# EasyEDA Pro project ProProject_工科大_2023-11-10.epro, board master control
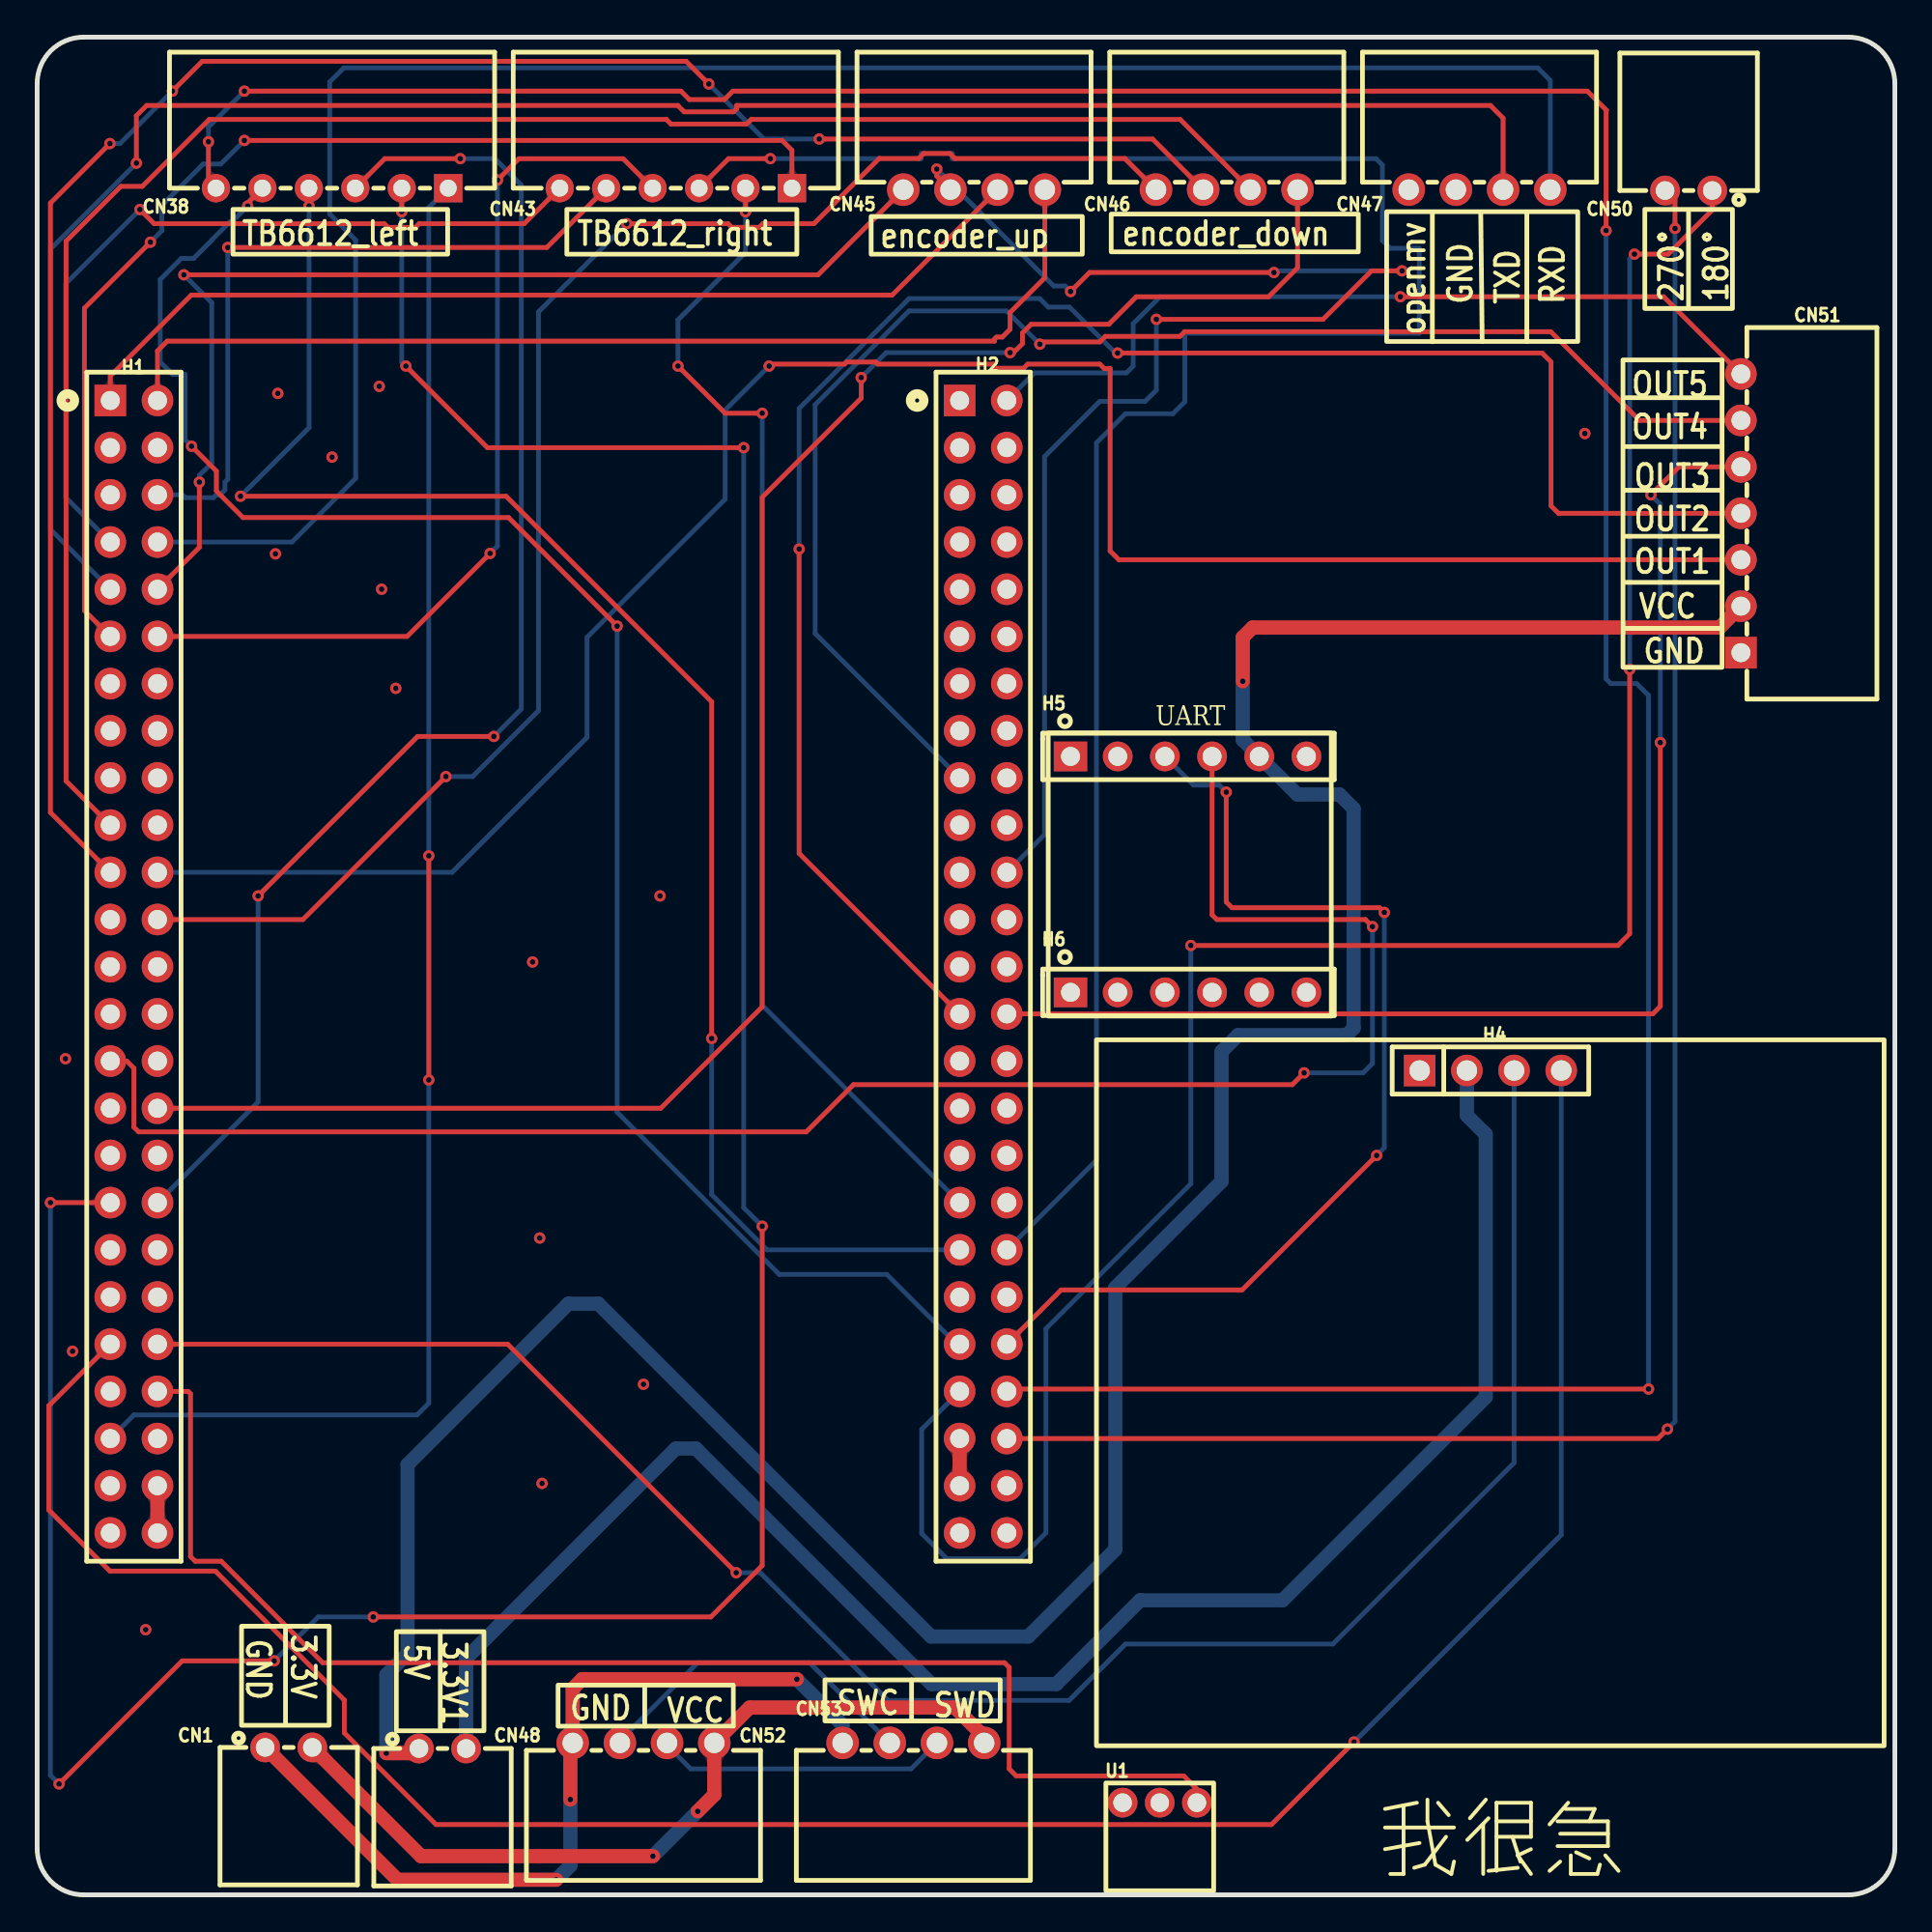
[diagram p3: board, top side]
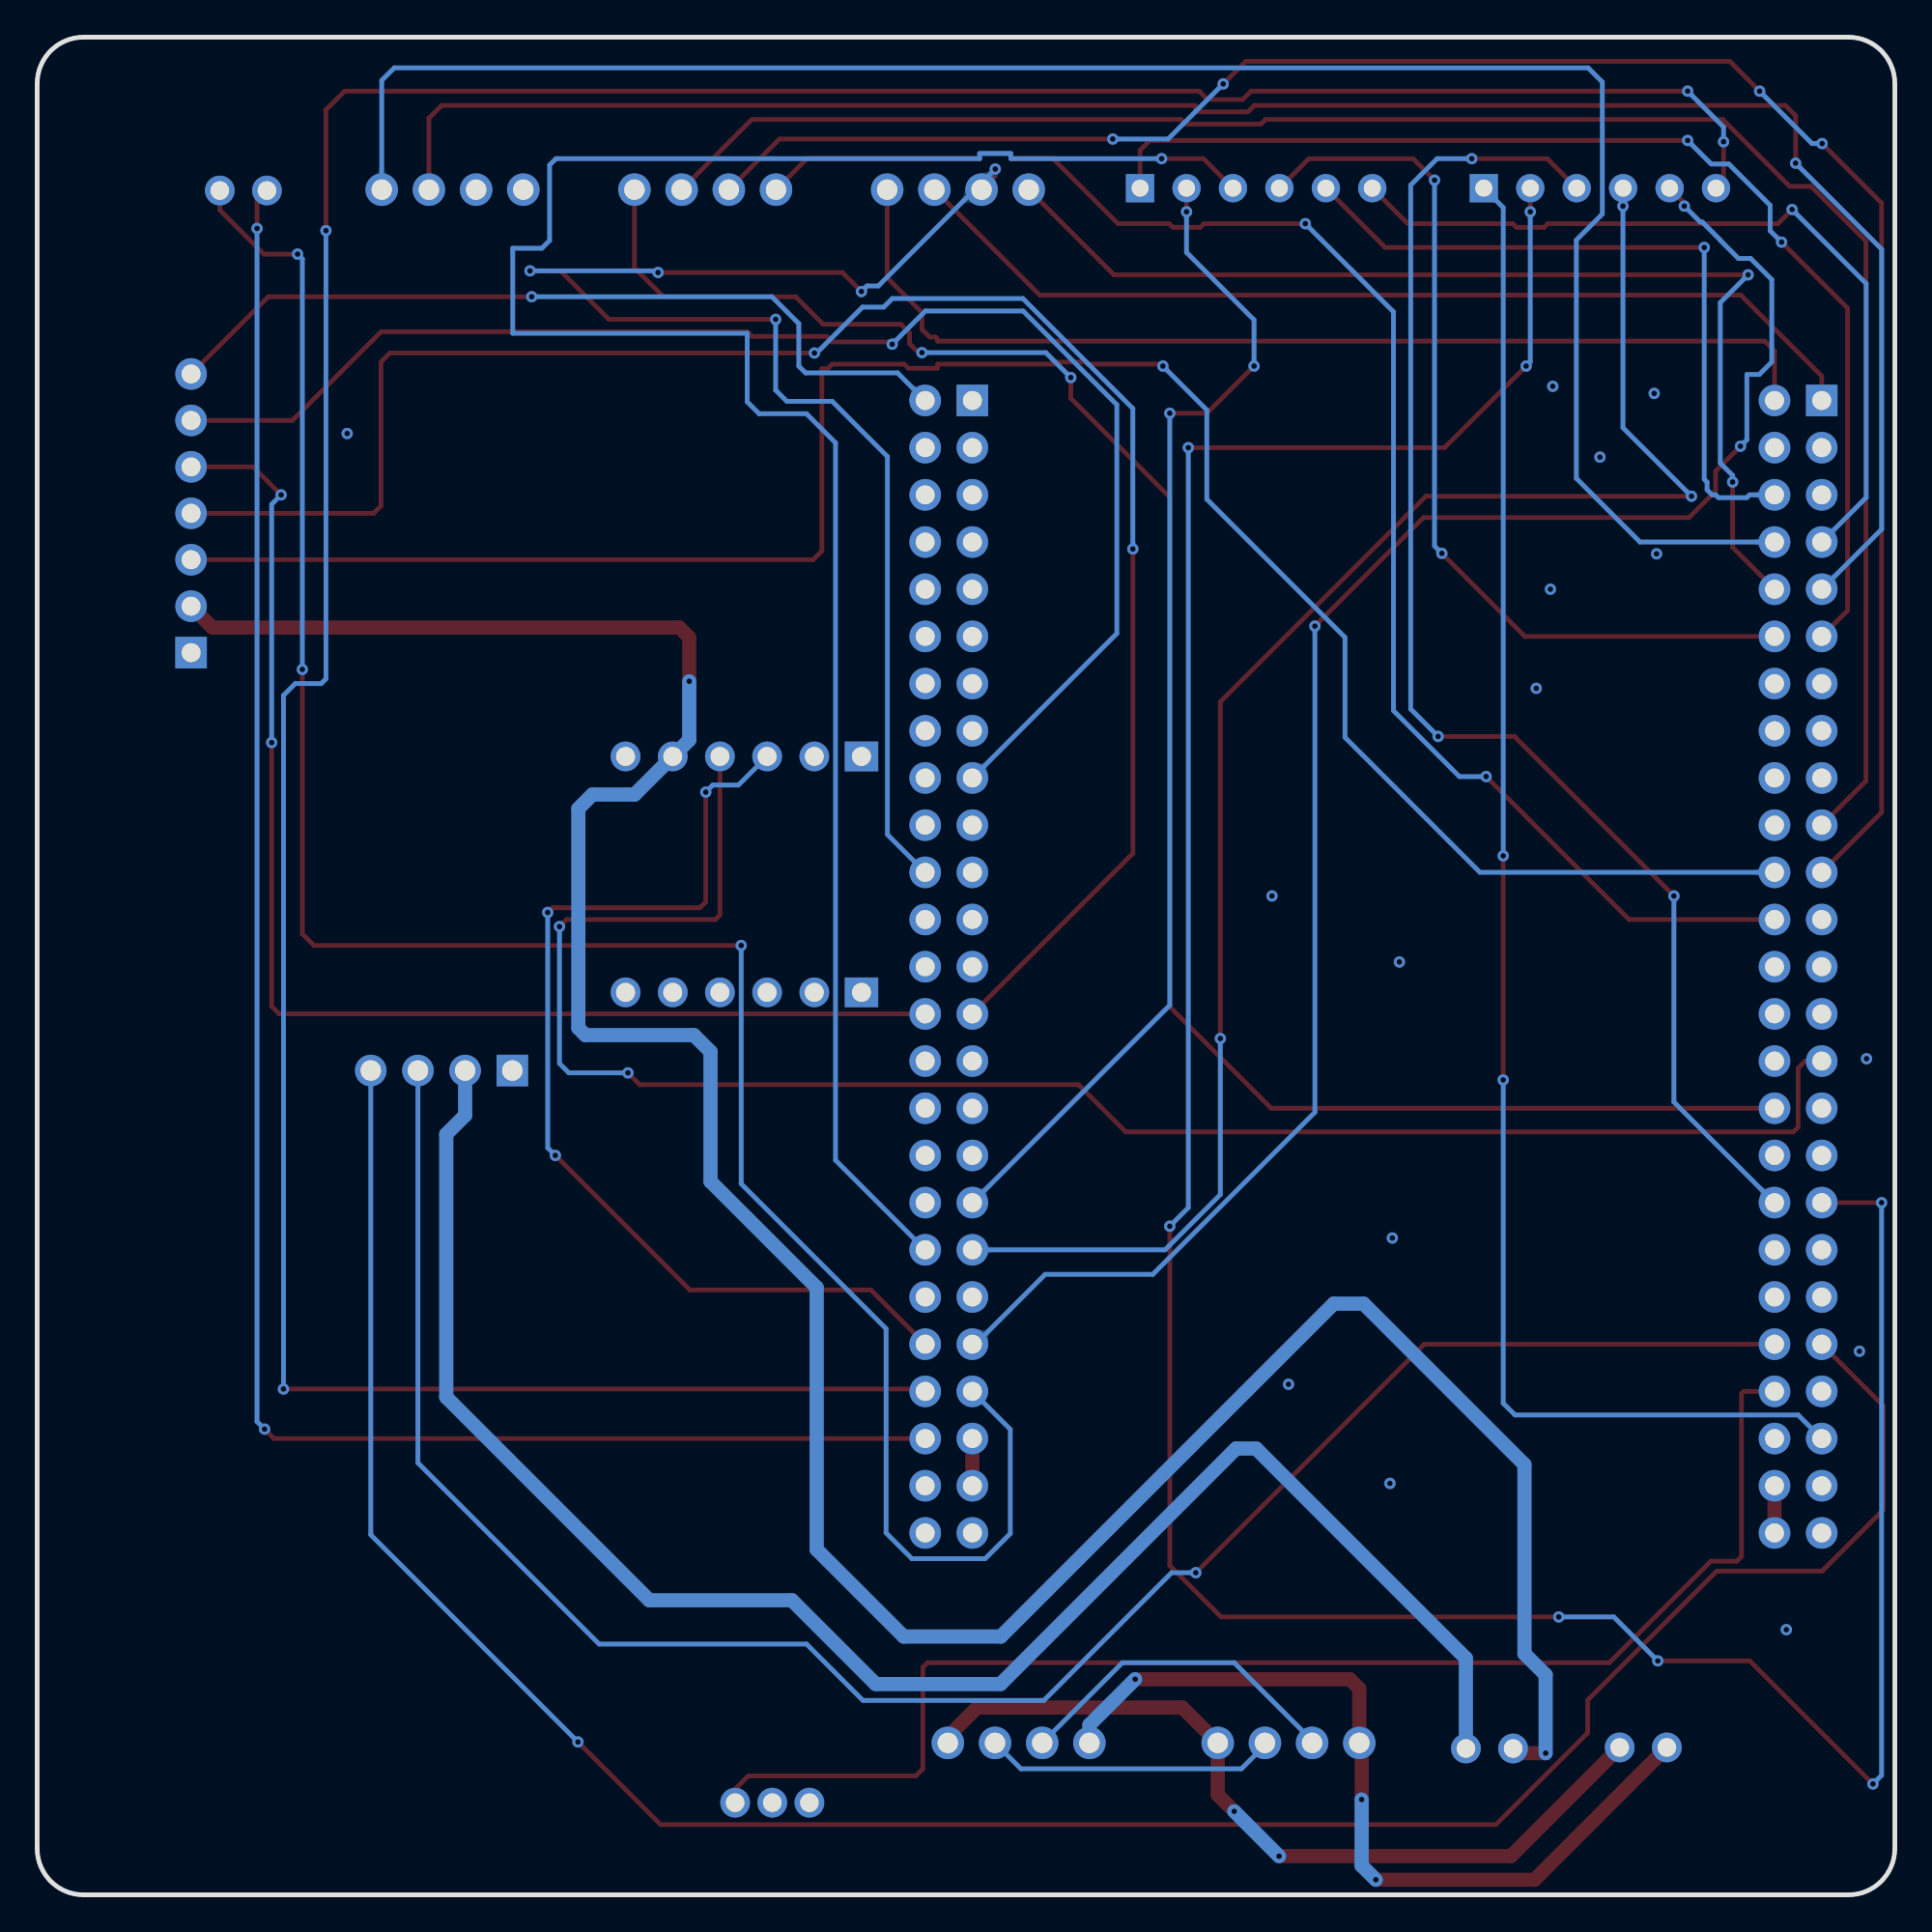
[diagram p4: board, bottom side, seen from below]

Outline 100 x 100 mm; copper layers: Top Layer, Bottom Layer. Coordinates in mm from the lower left corner of the outline.
Outline path: 0,97.5 0,2.5 arc(0.73,0.73) 2.5,0 97.5,0 arc(99.27,0.73) 100,2.5 100,97.5 arc(99.27,99.27) 97.5,100 2.5,100 arc(0.73,99.27) 0,97.5
Stack: Top Layer 0.035mm / Dielectric1 1.51mm FR4 er 4.5 / Bottom Layer 0.035mm

## Design rules (mm)
template: 我很急
spacing copperThickness1oz: track to track 0.102, other pairs 0.152 to 0.3
spacing copperThickness2oz (default): track to track 0.203, other pairs 0.203 to 0.203
spacing VCC和GND: track to track 0.762, other pairs 0.152 to 0.3
track width copperThickness1oz (default): min 0.254, default 0.254, max 1.016
track width copperThickness2oz: min 0.203, default 0.254, max 2.54
track width VCC AND GND: min 0.254, default 0.762, max 0.762
track width 9.6V: min 0.762, default 1.016, max 1.016
differential pair differentialPair (default): width min 0.127, default 0.254, max 2.54; gap min 0.152, default 0.152
via viaSize (default): diameter min 0.5, default 0.61, max 10; hole min 0.3, default 0.305, max 6.299
net GND uses VCC AND GND
net 5V uses VCC AND GND
net VREF uses VCC AND GND
net 3.3V uses VCC AND GND
net 3.3V1 uses VCC AND GND

## Placement (name value [footprint] x y rotation side)
CN1  3.3V  [CONN-TH_XH-2AW_C2908611]  13.54 7.94 0 top
CN38  TB6612 1  [CONN-TH_6P-P2.50_HC-XH-6AW-G]  15.88 91.87 180 top
CN43  TB6612 1  [CONN-TH_6P-P2.50_HC-XH-6AW-G]  34.38 91.87 180 top
CN45  编码器上  [CONN-TH_XH-4AW]  50.43 91.79 180 top
CN46  编码器下  [CONN-TH_XH-4AW]  64.04 91.79 180 top
CN47  openmv  [CONN-TH_XH-4AW]  77.64 91.79 180 top
CN48  3.3V  [CONN-TH_XH-2AW_C2908611]  21.82 7.88 0 top
CN50  SERVO  [CONN-TH_XH-2AW_C2908611]  88.9 91.75 180 top
CN51  HC-XH-7AW-G  [CONN-TH_7P-P2.50_HC-XH-7AW-G]  91.71 74.37 90 top
CN52  XH-4AW  [CONN-TH_XH-4AW]  32.64 8.18 0 top
CN53  XH-4AW  [CONN-TH_XH-4AW]  47.17 8.18 0 top
H1  FH-00077  [HDR-TH_50P-P2.54-V-F-R2-C25-S2.54-1]  5.21 49.96 270 top
H2  FH-00077  [HDR-TH_50P-P2.54-V-F-R2-C25-S2.54-1]  50.93 49.96 270 top
H4  PM254V-11-04-H85  [HDR-TH_4P-P2.54-V-F]  78.23 44.37 0 top
H5  PM254V-11-06-H85  [HDR-TH_6P-P2.54-V-F]  61.98 61.28 0 top
H6  PM254V-11-06-H85  [HDR-TH_6P-P2.54-V-F]  61.98 48.58 0 top
U1  -  [按键开关]  58.17 5.13 0 top

## Footprints (pads in the part's own frame, mm; a bottom-side part is the same pattern mirrored in y, then rotated)
CONN-TH_6P-P2.50_HC-XH-6AW-G
  rect 1.524x1.524 hole 0.914: 1(-6.25,0)
  round 1.524 hole 0.914: 2(-3.75,0) 3(-1.25,0) 4(1.25,0) 5(3.75,0) 6(6.25,0)
CONN-TH_7P-P2.50_HC-XH-7AW-G
  rect 1.7x1.7 hole 1.02: 1(-7.5,0)
  round 1.7 hole 1.02: 2(-5,0) 3(-2.5,0) 4(0,0) 5(2.5,0) 6(5,0) 7(7.5,0)
CONN-TH_XH-2AW_C2908611
  round 1.6 hole 1: 1(-1.27,0) 2(1.27,0)
CONN-TH_XH-4AW
  round 1.75 hole 1.1: 1(-3.81,0) 2(-1.27,0) 3(1.27,0) 4(3.81,0)
HDR-TH_4P-P2.54-V-F
  rect 1.7x1.7 hole 1.1: 1(-3.81,0)
  round 1.7 hole 1.1: 2(-1.27,0) 3(1.27,0) 4(3.81,0)
HDR-TH_6P-P2.54-V-F
  rect 1.8x1.6 hole 1.02: 1(-6.35,0)
  round 1.6 hole 1.02: 2(-3.81,0) 3(-1.27,0) 4(1.27,0) 5(3.81,0) 6(6.35,0)
HDR-TH_50P-P2.54-V-F-R2-C25-S2.54-1
  rect 1.7x1.7 hole 1.02: 1(-30.48,-1.27)
  round 1.7 hole 1.02: 2(-30.48,1.27) 3(-27.94,-1.27) 4(-27.94,1.27) 5(-25.4,-1.27) 6(-25.4,1.27) 7(-22.86,-1.27) 8(-22.86,1.27) 9(-20.32,-1.27) 10(-20.32,1.27) 11(-17.78,-1.27) 12(-17.78,1.27) 13(-15.24,-1.27) 14(-15.24,1.27) 15(-12.7,-1.27) 16(-12.7,1.27) 17(-10.16,-1.27) 18(-10.16,1.27) 19(-7.62,-1.27) 20(-7.62,1.27) 21(-5.08,-1.27) 22(-5.08,1.27) 23(-2.54,-1.27) 24(-2.54,1.27) 25(0,-1.27) 26(0,1.27) 27(2.54,-1.27) 28(2.54,1.27) 29(5.08,-1.27) 30(5.08,1.27) 31(7.62,-1.27) 32(7.62,1.27) 33(10.16,-1.27) 34(10.16,1.27) 35(12.7,-1.27) 36(12.7,1.27) 37(15.24,-1.27) 38(15.24,1.27) 39(17.78,-1.27) 40(17.78,1.27) 41(20.32,-1.27) 42(20.32,1.27) 43(22.86,-1.27) 44(22.86,1.27) 45(25.4,-1.27) 46(25.4,1.27) 47(27.94,-1.27) 48(27.94,1.27) 49(30.48,-1.27) 50(30.48,1.27)
按键开关
  round 1.6 hole 1: 1(0.263,-0.17) 1(2.263,-0.17) 1(4.263,-0.17)

## Nets
As in the schematic, except:
3.3V: CN1.2 CN52.4 CN53.4
5V: CN48.1 CN51.2 H5.5
5V5: H1.48 H1.50
GND: CN1.1 CN47.3 CN51.1 CN52.1 CN53.1 H1.47 H1.49 H2.50 H4.1 H5.2 U1.1

Pads without a net: H5 1 6; H6 1 2 3 4 5 6

## Via types
v1: diameter 0.61, hole 0.305, Top Layer to Bottom Layer, 90 vias

## Routing (per net, layer and track width the routed paths; a pad name or vN(x,y) marks a point on that pad's centre or on a via; arc(x,y) is an arc through that point)
3.3V: length 44.5
  Top Layer w0.762: CN1.2 20.67,2.08 v1(33.15,2.08) ; CN53.4 50.98,8.51 49.4,10.08 38.35,10.08 CN52.4 36.45,5.38 v1(35.56,4.5)
  Bottom Layer w0.762: v1(33.15,2.08) v1(35.56,4.5)
3.3V1: length 94.1
  Bottom Layer w0.762: H4.2 76.96,41.96 77.98,40.94 77.98,26.79 67.05,15.86 59.37,15.86 54.86,11.35 48.14,11.35 35.46,24.03 34.38,24.03 23.09,12.73 CN48.2
5V: length 158.1
  Top Layer w0.762: v1(18.8,7.63) 20.3,7.63 CN48.1 ; CN51.2 90.57,68.22 65.43,68.22 64.9,67.69 v1(64.9,65.33)
  Bottom Layer w0.762: v1(64.9,65.33) 64.9,62.17 H5.5 67.83,59.23 70.1,59.23 70.87,58.47 70.87,46.66 70.49,46.28 64.64,46.28 63.75,45.39 63.75,38.41 58.04,32.69 58.04,18.59 53.35,13.9 48.12,13.9 30.2,31.82 28.6,31.82 19.94,23.16 19.94,12.98 18.8,11.84 v1(18.8,7.63)
5V5: length 2.5
  Top Layer w0.762: H1.48 H1.50
GND: length 46
  Top Layer w0.762: v1(28.7,5.13) 28.7,8.05 CN52.1 28.83,11.1 29.34,11.61 v1(40.89,11.61) ; v1(27.94,0.81) 19.39,0.81 CN1.1
  Bottom Layer w0.762: v1(27.94,0.81) 28.7,1.57 v1(28.7,5.13) ; v1(40.89,11.61) 43.36,9.15 CN53.1
  vias: v1(1.52,45.01) v1(1.91,29.26) v1(5.84,14.28) v1(12.83,72.19) v1(12.95,80.82) v1(15.88,77.39) v1(18.42,81.2) v1(18.54,70.28) v1(19.3,64.95) v1(26.67,50.22) v1(27.05,35.36) v1(27.18,22.15) v1(32.64,27.48) v1(33.53,53.77) v1(83.31,78.66)
PA1: length 102.8
  Top Layer w0.254: CN50.2 88.17,91.21 v1(88.17,89.7) ; H2.46 87.25,24.56 v1(87.76,25.07)
  Bottom Layer w0.254: v1(88.17,89.7) 88.17,25.48 v1(87.76,25.07)
PA2: length 118
  Top Layer w0.254: CN50.1 90.17,90.69 87.8,88.32 v1(85.98,88.32) ; v1(85.72,65.96) 85.72,51.74 85.09,51.11 v1(62.1,51.11)
  Bottom Layer w0.254: v1(85.72,65.96) 85.72,88.06 v1(85.98,88.32) ; v1(62.1,51.11) 62.1,38.28 54.3,30.48 54.3,19.49 52.91,18.1 48.97,18.1 47.62,19.45 47.62,25.06 H2.43
PA3: length 56.1
  Top Layer w0.254: H2.42 55.12,32.56 64.87,32.56 v1(72.1,39.8) ; v1(72.52,52.88) 72.26,53.14 64.32,53.14 64.01,53.45 v1(64.01,59.36)
  Bottom Layer w0.254: v1(72.52,52.88) 72.52,40.22 v1(72.1,39.8) ; v1(64.01,59.36) 63.63,59.74 62.25,59.74 H5.3
PA7: length 89.2
  Top Layer w0.254: v1(36.31,46.1) 36.31,64.22 25.24,75.29 v1(10.95,75.29) ; CN38.4 14.64,91.86 v1(14.64,90.91)
  Bottom Layer w0.254: v1(10.95,75.29) 14.64,78.98 v1(14.64,90.91) ; H2.37 39.28,34.72 36.31,37.7 v1(36.31,46.1)
PA8: length 59.4
  Top Layer w0.254: v1(7.9,87.21) 42.04,87.21 CN45.4 ; v1(8.73,76.05) 8.73,72.54 H1.10
  Bottom Layer w0.254: v1(8.73,76.05) 8.73,76.41 9.4,77.08 9.4,85.71 v1(7.9,87.21)
PA15: length 84.4
  Top Layer w0.254: v1(31.74,89.96) 37.19,89.96 37.39,89.76 38.87,89.76 39.07,89.96 41.81,89.96 45.32,93.47 47.45,93.47 47.72,93.74 49.13,93.74 49.4,93.47 58.55,93.47 CN46.4 ; v1(22,60.2) 14.31,52.5 H1.24
  Bottom Layer w0.254: v1(22,60.2) 23.44,60.2 26.99,63.74 26.99,85.21 v1(31.74,89.96)
PB3: length 105.4
  Top Layer w0.254: CN46.3 60.04,94.52 v1(42.1,94.52) ; v1(36.16,97.48) 34.94,98.7 8.89,98.7 v1(7.28,97.09) ; H1.21 0.71,58.26 0.71,91.07 v1(3.92,94.27)
  Bottom Layer w0.254: v1(3.92,94.27) 4.46,94.27 v1(7.28,97.09) ; v1(42.1,94.52) 39.12,94.52 v1(36.16,97.48)
PB4: length 83.8
  Top Layer w0.254: v1(21.08,55.93) v1(21.08,43.87)
  Bottom Layer w0.254: CN38.1 21.08,90.83 v1(21.08,55.93) ; v1(21.08,43.87) 21.08,26.47 20.45,25.83 5.21,25.83 H1.45
PB6: length 100.7
  Top Layer w0.254: CN46.2 61.53,95.57 38.44,95.57 38.19,95.32 34.12,95.32 33.87,95.57 9.26,95.57 5.66,91.97 4.51,91.97 1.56,89.02 1.56,59.96 H1.19
PB7: length 101.4
  Top Layer w0.254: v1(44.36,81.68) 44.36,80.57 39.03,75.24 39.03,47.8 33.57,42.34 H1.32 ; CN46.1 67.85,87.58 66.29,86.02 59.17,86.02 57.69,84.54 53.51,84.54 53.04,84.08 53.04,83.5 52.56,83.02 v1(52.37,83.02)
  Bottom Layer w0.254: v1(52.37,83.02) 45.7,83.02 v1(44.36,81.68)
PB11: length 113
  Top Layer w0.254: v1(39.4,82.3) 39.51,82.4 43.46,82.4 43.58,82.51 45.14,82.51 45.25,82.4 51.51,82.4 51.53,82.37 51.53,82.18 53.1,82.18 53.32,82.4 57.2,82.4 57.44,82.16 57.76,82.16 57.76,72.34 58.23,71.87 CN51.3
  Bottom Layer w0.254: v1(39.4,82.3) 37.04,79.93 37.04,75.13 29.6,67.69 29.6,62.31 22.33,55.04 H1.22
PB12: length 98.6
  Top Layer w0.254: v1(58.16,83) 81.01,83 81.49,82.52 81.49,74.77 81.89,74.37 CN51.4 ; H2.27 41.02,56.06 v1(41.02,72.45)
  Bottom Layer w0.254: v1(58.16,83) 58.04,83 55.57,85.47 54.43,85.47 53.97,85.93 46.94,85.93 41.02,80.01 v1(41.02,72.45)
PB13: length 68.6
  Top Layer w0.254: CN51.5 88.38,76.87 v1(86.87,75.36) ; v1(87.38,62.03) 87.38,47.83 86.97,47.42 H2.28
  Bottom Layer w0.254: v1(87.38,62.03) 87.38,74.85 v1(86.87,75.36)
PB15: length 44.9
  Top Layer w0.254: CN51.7 87.56,86.03 v1(73.38,86.03)
  Bottom Layer w0.254: v1(73.38,86.03) 60.45,86.03 59,84.58 59,82.29 58.64,81.93 53.68,81.93 H2.2
PC0: length 75.5
  Top Layer w0.254: v1(11.89,53.77) 20.48,62.36 v1(24.58,62.36) ; v1(22.77,93.46) 18.71,93.46 CN38.3
  Bottom Layer w0.254: v1(11.89,53.77) 11.89,42.68 H1.36 ; v1(22.77,93.46) 24.64,93.46 26.06,92.03 26.06,63.84 v1(24.58,62.36)
PC1: length 167.7
  Top Layer w0.254: v1(39.03,35.99) 39.03,17.73 36.26,14.96 v1(18.09,14.96) ; v1(38.03,77.9) 24.24,77.9 v1(19.85,82.29) ; v1(12.76,12.59) 7.8,12.59 v1(1.18,5.97) ; H1.35 v1(0.71,37.26) ; v1(19.62,90.6) CN38.2
  Bottom Layer w0.254: v1(39.03,35.99) 38.03,36.99 v1(38.03,77.9) ; v1(1.18,5.97) 0.71,6.44 v1(0.71,37.26) ; v1(19.85,82.29) 19.62,82.52 v1(19.62,90.6) ; v1(12.76,12.59) 15.13,14.96 v1(18.09,14.96)
PC2: length 95
  Top Layer w0.254: v1(31.22,68.3) 25.38,74.14 11.08,74.14 9.65,75.57 9.65,76.64 v1(8.31,77.98) ; CN38.5 11.33,91.08 v1(11.33,90.91)
  Bottom Layer w0.254: v1(11.33,90.91) 10.47,90.05 10.37,90.05 9.4,89.08 9.4,89.07 8.42,88.09 7.76,88.09 6.63,86.95 6.63,82.51 7.3,81.84 7.97,81.84 7.97,78.32 v1(8.31,77.98) ; H2.41 49.49,29.64 45.74,33.4 39.95,33.4 31.22,42.13 v1(31.22,68.3)
PC3: length 185.5
  Top Layer w0.254: CN38.6 9.22,92.28 v1(9.22,94.37) ; v1(86.74,27.23) 52.32,27.23 H2.44 ; v1(11.15,97.09) 34.66,97.09 35.11,96.64 36.99,96.64 37.45,97.09 83.45,97.09 84.47,96.07 84.46,96.05 v1(84.46,89.59)
  Bottom Layer w0.254: v1(86.74,27.23) 86.74,64.57 86.11,65.2 84.71,65.2 84.46,65.46 v1(84.46,89.59) ; v1(9.22,94.37) 9.22,95.16 v1(11.15,97.09)
PC4: length 116.4
  Top Layer w0.254: CN43.3 37.22,93.46 v1(39.47,93.46)
  Bottom Layer w0.254: v1(39.47,93.46) 47.59,93.46 47.59,93.74 49.26,93.74 49.26,93.46 72.07,93.46 72.41,93.12 72.41,89.05 72.83,88.64 74.4,88.64 74.4,84.06 61.78,84.06 61.78,80.37 61.13,79.73 58.58,79.73 57.02,78.17 57.02,39.55 H2.38
PC5: length 63.6
  Top Layer w0.254: v1(39.03,79.76) 37.03,79.76 v1(34.5,82.3) ; v1(38.13,90.6) CN43.2
  Bottom Layer w0.254: v1(39.03,79.76) 39.03,47.89 H2.35 ; v1(38.13,90.6) 38.13,88.42 34.5,84.78 v1(34.5,82.3)
PC6: length 53.2
  Top Layer w0.254: CN45.2 46.03,86.12 8.3,86.12 3.94,81.76 H1.1
PC7: length 57.4
  Top Layer w0.254: CN45.1 54.24,87.05 52.37,85.18 52.37,84.28 51.95,83.86 51.64,83.86 51.53,83.75 51.53,83.64 7,83.64 6.48,83.11 H1.2
PC8: length 63.1
  Top Layer w0.254: H1.11 2.55,69.13 2.55,85.41 v1(6.1,88.96) ; CN43.1 40.63,93.92 40.1,94.44 v1(11.15,94.44)
  Bottom Layer w0.254: v1(6.1,88.96) 6.71,89.58 6.71,90.95 8.93,93.17 9.89,93.17 v1(11.15,94.44)
PC9: length 49.5
  Top Layer w0.254: v1(24.38,72.21) 19.92,67.74 H1.12 ; v1(24.78,92.3) 25.93,93.46 31.54,93.46 CN43.4
  Bottom Layer w0.254: v1(24.38,72.21) 24.78,72.61 v1(24.78,92.3)
PC10: length 38.7
  Top Layer w0.254: v1(10.26,88.68) 27.44,88.68 CN43.5
  Bottom Layer w0.254: H1.6 7.82,75.36 7.97,75.21 9.49,75.21 9.64,75.36 9.84,75.36 10.11,75.63 10.11,76.05 10.26,76.2 v1(10.26,88.68)
PC11: length 44.4
  Top Layer w0.254: CN43.6 26.22,89.96 20.56,89.96 20.37,89.76 18.89,89.76 18.69,89.96 6.3,89.96 v1(5.53,90.72)
  Bottom Layer w0.254: v1(5.53,90.72) 1.54,86.73 1.54,75.22 H1.7
PC12: length 107.1
  Top Layer w0.254: v1(5.34,93.22) 5.34,93.22 5.34,95.77 5.89,96.32 34.49,96.32 34.83,95.98 37.48,95.98 37.65,96.15 37.65,96.32 78.23,96.32 78.91,95.64 CN47.2
  Bottom Layer w0.254: v1(5.34,93.22) 0.71,88.58 0.71,73.51 H1.9
PD2: length 106.2
  Bottom Layer w0.254: H1.8 13.72,72.82 17.14,76.25 17.14,89.08 15.75,90.47 15.75,97.59 16.51,98.35 80.77,98.35 81.45,97.67 CN47.1
PD5: length 97.7
  Top Layer w0.254: v1(68.2,44.25) 67.56,43.61 43.94,43.61 41.4,41.07 5.46,41.07 5.21,41.33 5.21,44.5 4.83,44.88 H1.29 ; H5.4 63.25,52.76 63.5,52.5 71.5,52.5 v1(71.88,52.12)
  Bottom Layer w0.254: v1(71.88,52.12) 71.88,44.75 71.37,44.25 v1(68.2,44.25)
PE11: length 78.5
  Top Layer w0.254: v1(60.25,84.81) 69.22,84.81 71.83,87.42 v1(73.47,87.42) ; v1(66.58,87.33) 56.65,87.33 v1(55.63,86.31) ; 49.16,91.79 48.43,92.53 v1(48.43,92.9)
  Bottom Layer w0.254: v1(66.58,87.33) 66.67,87.42 v1(73.47,87.42) ; v1(48.43,92.9) 54.72,86.61 55.33,86.61 v1(55.63,86.31) ; v1(60.25,84.81) 60.25,81 59.64,80.4 57.2,80.4 54.23,77.42 54.23,57.07 H2.22
PE13: length 78.2
  Top Layer w0.254: v1(53.97,83.47) 54.1,83.6 57.2,83.6 57.5,83.89 61.51,83.89 61.77,84.14 81.48,84.14 86.26,79.37 CN51.6
  Bottom Layer w0.254: v1(53.97,83.47) 52.18,85.26 46.93,85.26 41.88,80.21 41.88,67.9 H2.17
PG11: length 131.2
  Top Layer w0.254: H1.41 0.63,26.33 0.63,20.72 3.92,17.43 9.59,17.43 16.53,10.49 16.53,8.72 21.47,3.78 66.44,3.78 v1(70.89,8.23)
  Bottom Layer w0.254: v1(70.89,8.23) 82.04,19.38 H4.4
PG12: length 107.4
  Top Layer w0.254: H1.42 25.33,29.64 v1(37.63,17.34)
  Bottom Layer w0.254: H4.3 79.5,23.25 69.75,13.5 58.58,13.5 55.55,10.47 45.81,10.47 38.93,17.34 v1(37.63,17.34)
PG14: length 73.9
  Top Layer w0.254: H1.44 8.13,27.1 8.25,26.97 8.25,18.21 8.51,17.96 9.91,17.96 15.37,12.5 52.07,12.5 52.32,12.24 52.32,6.78 52.71,6.4 61.72,6.4 62.43,5.69 62.43,4.96
SWC: length 18.2
  Bottom Layer w0.254: CN52.2 31.37,8.31 35.56,12.5 41.58,12.5 CN53.2
SWD: length 15.8
  Bottom Layer w0.254: 33.91,8.18 33.91,8.05 35.18,6.78 47.04,6.78 CN53.3
VREF: length 2.5
  Top Layer w0.762: H2.45 H2.47

## Copper pours and planes (outline as drawn; the poured copper is in the pictures)
GND on Top Layer: -0.64,99.87 104.01,99.87 104.01,-1.98 -0.64,-1.98
GND on Bottom Layer: 0.25,100.13 103.12,100.13 103.12,-1.98 0.25,-1.98

Small or netless copper shapes (teardrops, artwork), in the pictures only: 103 on Top Layer, 67 on Bottom Layer

## Text on the board
Top Silkscreen Layer: openmv | GND | TXD | RXD | TB6612_left | TB6612_right | VCC | SWC | encoder_up | SWD | encoder_down | OUT5 | OUT4 | OUT3 | OUT2 | OUT1 | 270° | 180° | 3.3V | 5V | 3.3V1 | UART | 我很急
